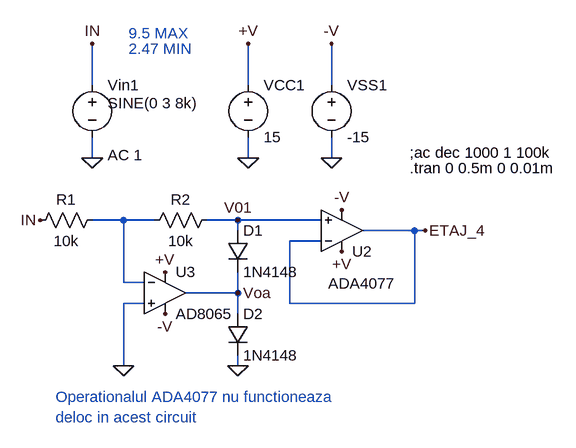
[diagram p0: schematic ET4.asc]
ET4.asc, the LTspice schematic file:
Version 4
SHEET 1 1048 680
WIRE -272 -240 -272 -304
WIRE -32 -240 -32 -304
WIRE 96 -240 96 -304
WIRE -272 -128 -272 -160
WIRE -32 -128 -32 -160
WIRE 96 -128 96 -160
WIRE -224 -32 -272 -32
WIRE -176 -32 -224 -32
WIRE -48 -32 -96 -32
WIRE 80 -32 -48 -32
WIRE -48 -16 -48 -32
WIRE 224 -16 144 -16
WIRE 240 -16 224 -16
WIRE 80 0 32 0
WIRE -224 64 -224 -32
WIRE -192 64 -224 64
WIRE -48 80 -48 48
WIRE -48 80 -128 80
WIRE -192 96 -224 96
WIRE 32 96 32 0
WIRE 224 96 224 -16
WIRE 224 96 32 96
WIRE -48 112 -48 80
WIRE -224 192 -224 96
WIRE -48 192 -48 176
FLAG -160 48 +V
FLAG 112 16 +V
FLAG -160 112 -V
FLAG 112 -48 -V
FLAG -224 192 0
FLAG -48 192 0
FLAG 240 -16 ETAJ_4
FLAG -272 -128 0
FLAG -272 -304 IN
FLAG -32 -128 0
FLAG 96 -128 0
FLAG -32 -304 +V
FLAG 96 -304 -V
FLAG -48 80 Voa
FLAG -352 -32 IN
FLAG -48 -32 V01
SYMBOL OpAmps\\ADA4077 112 48 M180
WINDOW 3 -21 -17 Left 2
SYMATTR InstName U2
SYMBOL res -256 -48 R90
WINDOW 0 0 56 VBottom 2
WINDOW 3 32 56 VTop 2
SYMATTR InstName R1
SYMATTR Value 10k
SYMBOL res -80 -48 R90
WINDOW 0 0 56 VBottom 2
WINDOW 3 32 56 VTop 2
SYMATTR InstName R2
SYMATTR Value 10k
SYMBOL voltage -272 -256 R0
WINDOW 123 24 124 Left 2
WINDOW 39 0 0 Left 2
WINDOW 3 24 44 Left 2
SYMATTR Value2 AC 1
SYMATTR Value SINE(0 3 8k)
SYMATTR InstName Vin1
SYMBOL voltage -32 -256 R0
WINDOW 123 0 0 Left 2
WINDOW 39 0 0 Left 2
SYMATTR InstName VCC1
SYMATTR Value 15
SYMBOL voltage 96 -256 R0
WINDOW 123 0 0 Left 2
WINDOW 39 0 0 Left 2
SYMATTR InstName VSS1
SYMATTR Value -15
SYMBOL diode -64 -16 R0
SYMATTR InstName D1
SYMATTR Value 1N4148
SYMBOL diode -64 112 R0
SYMATTR InstName D2
SYMATTR Value 1N4148
SYMBOL OpAmps\\AD8065 -160 16 R0
SYMATTR InstName U3
TEXT -216 -320 Left 2 ;9.5 MAX
TEXT -216 -296 Left 2 ;2.47 MIN
TEXT 216 -112 Left 2 !.tran 0 0.5m 0 0.01m
TEXT 216 -136 Left 2 !;ac dec 1000 1 100k
TEXT -328 240 Left 2 ;Operationalul ADA4077 nu functioneaza \ndeloc in acest circuit

The netlist it stands for:
* ET4.asc
XU2 V01 ETAJ_4 +V -V ETAJ_4 ADA4077  ; pins In+ In- V+ V- OUT
R1 N001 IN 10k
R2 V01 N001 10k
Vin1 IN 0 SINE(0 3 8k) AC 1
VCC1 +V 0 15
VSS1 -V 0 -15
D1 V01 Voa 1N4148
D2 Voa 0 1N4148
XU3 0 N001 +V -V Voa AD8065  ; pins In+ In- V+ V- OUT
.model D D
.lib standard.dio
* 9.5 MAX
* 2.47 MIN
.tran 0 0.5m 0 0.01m
;ac dec 1000 1 100k
* Operationalul ADA4077 nu functioneaza
* deloc in acest circuit
.backanno
.end